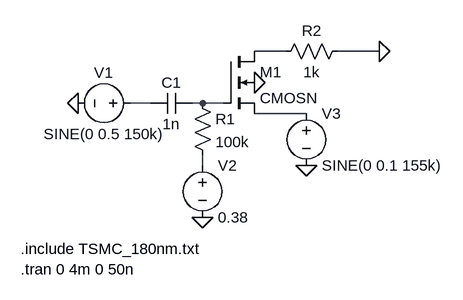
[diagram p0: schematic Mixer.asc]
Mixer.asc, the LTspice schematic file:
Version 4.1
SHEET 1 880 680
WIRE 256 96 208 96
WIRE 400 96 336 96
WIRE 48 176 16 176
WIRE 128 176 112 176
WIRE 160 176 128 176
WIRE 288 192 208 192
WIRE 128 272 128 256
FLAG 400 96 0
FLAG -64 176 0
FLAG 128 352 0
FLAG 288 272 0
FLAG 208 144 0
SYMBOL nmos4 160 96 R0
SYMATTR InstName M1
SYMATTR Value CMOSN
SYMATTR Value2 l=0.18u w=10u ad=5p as=5p pd=21u ps=21u
SYMBOL cap 112 160 R90
WINDOW 0 0 32 VBottom 2
WINDOW 3 32 32 VTop 2
SYMATTR InstName C1
SYMATTR Value 1n
SYMBOL res 112 160 R0
SYMATTR InstName R1
SYMATTR Value 100k
SYMBOL res 352 80 R90
WINDOW 0 0 56 VBottom 2
WINDOW 3 32 56 VTop 2
SYMATTR InstName R2
SYMATTR Value 1k
SYMBOL voltage 32 176 R90
WINDOW 0 -32 56 VBottom 2
WINDOW 3 32 56 VTop 2
WINDOW 123 0 0 Left 0
WINDOW 39 0 0 Left 0
SYMATTR InstName V1
SYMATTR Value SINE(0 0.5 150k)
SYMBOL voltage 128 256 R0
WINDOW 123 0 0 Left 0
WINDOW 39 0 0 Left 0
SYMATTR InstName V2
SYMATTR Value 0.38
SYMBOL voltage 288 176 R0
WINDOW 123 0 0 Left 0
WINDOW 39 0 0 Left 0
SYMATTR InstName V3
SYMATTR Value SINE(0 0.1 155k)
TEXT -152 400 Left 2 !.include TSMC_180nm.txt
TEXT -152 432 Left 2 !.tran 0 4m 0 50n

The netlist it stands for:
* Mixer.asc
M1 N001 N003 N004 0 CMOSN l=0.18u w=10u ad=5p as=5p pd=21u ps=21u
C1 N003 N002 1n
R1 N003 N005 100k
R2 0 N001 1k
V1 N002 0 SINE(0 0.5 150k)
V2 N005 0 0.38
V3 N004 0 SINE(0 0.1 155k)
.model NMOS NMOS
.model PMOS PMOS
.lib standard.mos
.include TSMC_180nm.txt
.tran 0 4m 0 50n
.backanno
.end